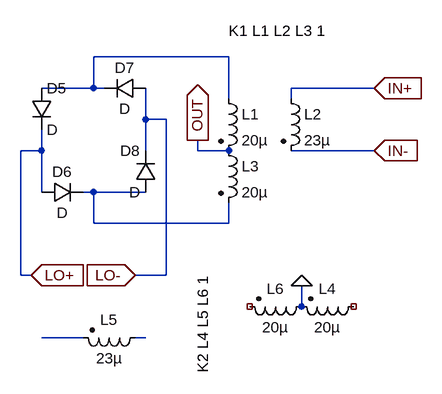
[diagram p0: schematic Ring_Diode_Mixer.asc]
Ring_Diode_Mixer.asc, the LTspice schematic file:
Version 4
SHEET 1 880 972
WIRE 320 336 112 336
WIRE 112 384 112 336
WIRE 112 384 32 384
WIRE 128 384 112 384
WIRE 544 384 416 384
WIRE 320 400 320 336
WIRE 416 400 416 384
WIRE 192 432 192 384
WIRE 224 432 192 432
WIRE 32 480 32 448
WIRE 32 480 0 480
WIRE 192 480 192 432
WIRE 272 480 272 464
WIRE 320 480 272 480
WIRE 544 480 416 480
WIRE 32 544 32 480
WIRE 112 544 96 544
WIRE 192 544 112 544
WIRE 112 592 112 544
WIRE 320 592 320 560
WIRE 320 592 112 592
WIRE 0 672 0 480
WIRE 16 672 0 672
WIRE 224 672 224 432
WIRE 224 672 176 672
WIRE 432 720 432 688
WIRE 96 768 32 768
WIRE 192 768 176 768
FLAG 544 384 IN+
IOPIN 544 384 In
FLAG 16 672 LO+
IOPIN 16 672 In
FLAG 272 464 OUT
IOPIN 272 464 Out
FLAG 176 672 LO-
IOPIN 176 672 In
FLAG 432 688 0
FLAG 544 480 IN-
IOPIN 544 480 In
SYMBOL diode 16 384 R0
SYMATTR InstName D5
SYMBOL diode 192 368 R90
WINDOW 0 0 32 VBottom 2
WINDOW 3 32 32 VTop 2
SYMATTR InstName D7
SYMBOL diode 208 544 R180
WINDOW 0 24 64 Left 2
WINDOW 3 24 0 Left 2
SYMATTR InstName D8
SYMBOL diode 32 560 R270
WINDOW 0 32 32 VTop 2
WINDOW 3 0 32 VBottom 2
SYMATTR InstName D6
SYMBOL ind2 304 384 R0
SYMATTR InstName L1
SYMATTR Value 20µ
SYMATTR Type ind
SYMBOL ind2 400 384 R0
SYMATTR InstName L2
SYMATTR Value 23µ
SYMATTR Type ind
SYMBOL ind2 304 464 R0
SYMATTR InstName L3
SYMATTR Value 20µ
SYMATTR Type ind
SYMBOL ind2 528 704 R90
WINDOW 0 4 56 VBottom 2
WINDOW 3 32 56 VTop 2
SYMATTR InstName L4
SYMATTR Value 20µ
SYMATTR Type ind
SYMBOL ind2 192 752 R90
WINDOW 0 4 56 VBottom 2
WINDOW 3 32 56 VTop 2
SYMATTR InstName L5
SYMATTR Value 23µ
SYMATTR Type ind
SYMBOL ind2 448 704 R90
WINDOW 0 4 56 VBottom 2
WINDOW 3 32 56 VTop 2
SYMATTR InstName L6
SYMATTR Value 20µ
SYMATTR Type ind
TEXT 320 296 Left 2 !K1 L1 L2 L3 1
TEXT 280 672 VRight 2 !K2 L4 L5 L6 1

The netlist it stands for:
* Ring_Diode_Mixer.asc
D5 N001 LO+ D
D7 LO- N001 D
D8 N002 LO- D
D6 LO+ N002 D
L1 N001 OUT 20µ
L2 IN+ IN- 23µ
L3 OUT N002 20µ
L4 NC_01 0 20µ
L5 N004 N003 23µ
L6 0 NC_02 20µ
.model D D
.lib standard.dio
K1 L1 L2 L3 1
K2 L4 L5 L6 1
.backanno
.end